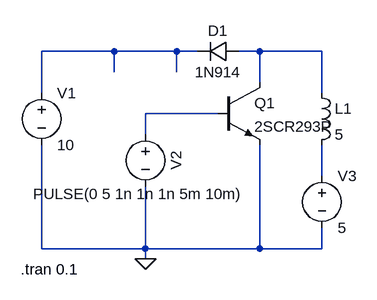
[diagram p0: schematic StepUp_Chopper_R2.asc]
StepUp_Chopper_R2.asc, the LTspice schematic file:
Version 4
SHEET 1 880 680
WIRE 368 112 256 112
WIRE 464 112 368 112
WIRE 496 112 464 112
WIRE 592 112 560 112
WIRE 688 112 592 112
WIRE 368 144 368 112
WIRE 464 144 464 112
WIRE 592 160 592 112
WIRE 256 176 256 112
WIRE 688 176 688 112
WIRE 528 208 416 208
WIRE 416 240 416 208
WIRE 688 304 688 256
WIRE 256 416 256 256
WIRE 416 416 416 320
WIRE 416 416 256 416
WIRE 592 416 592 256
WIRE 592 416 416 416
WIRE 688 416 688 384
WIRE 688 416 592 416
WIRE 416 432 416 416
FLAG 416 432 0
SYMBOL voltage 256 160 R0
WINDOW 123 0 0 Left 0
WINDOW 39 0 0 Left 0
SYMATTR InstName V1
SYMATTR Value 10
SYMBOL npn 528 160 R0
SYMATTR InstName Q1
SYMATTR Value 2SCR293P
SYMBOL voltage 416 224 R0
WINDOW 0 32 56 VTop 2
WINDOW 3 -11 92 Top 2
WINDOW 123 0 0 Left 0
WINDOW 39 0 0 Left 0
SYMATTR InstName V2
SYMATTR Value PULSE(0 5 1n 1n 1n 5m 10m)
SYMBOL diode 560 96 R90
WINDOW 0 0 32 VBottom 2
WINDOW 3 32 32 VTop 2
SYMATTR InstName D1
SYMATTR Value 1N914
SYMBOL ind 672 160 R0
SYMATTR InstName L1
SYMATTR Value 5
SYMBOL voltage 688 288 R0
WINDOW 123 0 0 Left 0
WINDOW 39 0 0 Left 0
SYMATTR InstName V3
SYMATTR Value 5
TEXT 224 448 Left 2 !.tran 0.1

The netlist it stands for:
* StepUp_Chopper_R2.asc
V1 N001 0 10
Q1 N002 N003 0 0 2SCR293P
V2 N003 0 PULSE(0 5 1n 1n 1n 5m 10m)
D1 N002 N001 1N914
L1 N002 N004 5
V3 N004 0 5
.model D D
.lib standard.dio
.model NPN NPN
.model PNP PNP
.lib standard.bjt
.tran 0.1
.backanno
.end